# EAGLE design ArduinoUhr_LCD (EAGLE 9.6.2)
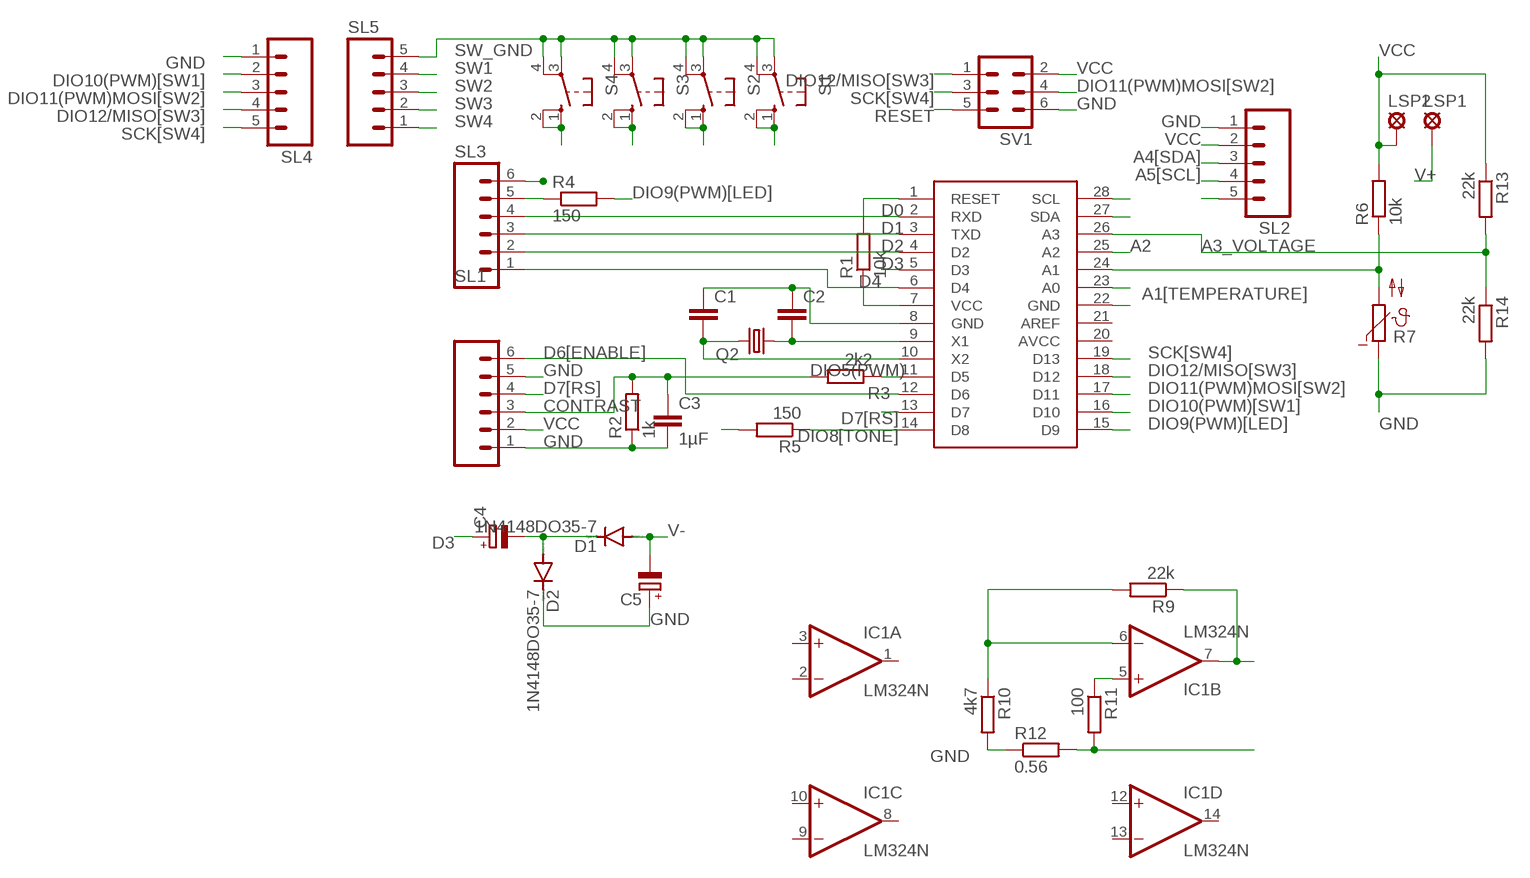
[diagram p0: schematic, sheet 1]

## Parts
C1  C-EU025-024X044  [C025-024X044]
C2  C-EU025-024X044  [C025-024X044]
C3  1µF  C-EU050-024X044  [C050-024X044]
C4  CPOL-EUE2-5  [E2-5]
C5  CPOL-EUE2-5  [E2-5]
D1  1N4148DO35-7  [DO35-7]
D2  1N4148DO35-7  [DO35-7]
IC1  LM324N  [DIL14]
LSP1  LSP10  [LSP10]
LSP2  LSP10  [LSP10]
Q2  CRYSTALHC49S  [HC49/S]
R1  10k  R-EU_0207/15  [0207/15]
R2  1k  R-EU_0204/7  [0204/7]
R3  2k2  R-EU_0204/7  [0204/7]
R4  150  R-EU_0207/10  [0207/10]
R5  150  R-EU_0204/7  [0204/7]
R6  10k  R-EU_0207/10  [0207/10]
R7  NTC640-9  [N640]
R9  22k  R-EU_0204/7  [0204/7]
R10  4k7  R-EU_0204/7  [0204/7]
R11  100  R-EU_0204/7  [0204/7]
R12  0.56  R-EU_0613/15  [P0613/15]
R13  22k  R-EU_0204/7  [0204/7]
R14  22k  R-EU_0204/7  [0204/7]
S1  10-XX  [B3F-10XX]
S2  10-XX  [B3F-10XX]
S3  10-XX  [B3F-10XX]
S4  10-XX  [B3F-10XX]
SL1  M06  [06P]
SL2  M05  [05P]
SL3  M06  [06P]
SL4  M05  [05P]
SL5  M05  [05P]
SV1  MA03-2  [MA03-2]
U$1  ATMEGA328P-PU  [DIL28-3]

## Nets
A0[CURRENT]: IC1.7(B:OUT) R9.1 U$1.23(A0)
A1[TEMPERATURE]: R6.1 R7.2 U$1.24(A1)
A2: U$1.25(A2)
A3_VOLTAGE: R13.2 R14.1 U$1.26(A3)
A4[SDA]: SL2.3 U$1.27(SDA)
A5[SCL]: SL2.4 U$1.28(SCL)
CONTRAST: C3.1 R2.2 R3.2 SL1.3
D0: SL3.4 U$1.2(RXD)
D1: SL3.3 U$1.3(TXD)
D2: SL3.2 U$1.4(D2)
D3: C4.+ U$1.5(D3)
D4: SL3.1 U$1.6(D4)
D6[ENABLE]: SL1.6 U$1.12(D6)
D7[RS]: SL1.4 U$1.13(D7)
DIO5(PWM): R3.1 U$1.11(D5)
DIO8[TONE]: R5.1 U$1.14(D8)
DIO9(PWM)[LED]: R4.2 U$1.15(D9)
DIO10(PWM)[SW1]: SL4.2 U$1.16(D10)
DIO11(PWM)MOSI[SW2]: SL4.3 SV1.4 U$1.17(D11)
DIO12/MISO[SW3]: SL4.4 SV1.1 U$1.18(D12)
GND: C1.1 C2.1 C3.2 C5.+ D2.C R2.1 R7.1 R10.2 R12.1 R14.2 SL1.1 SL1.5 SL2.1 SL3.6 SL4.1 SV1.6 U$1.8(GND) U$1.22(GND)
N$1: IC1.6(B:-IN) R9.2 R10.1
N$2: R4.1 SL3.5
N$4: C4.- D1.C D2.A
N$6: IC1.5(B:+IN) R11.1
N$7: SL2.5
N$8: R11.2 R12.2
RESET: R1.2 SV1.5 U$1.1(RESET)
SCK[SW4]: SL4.5 SV1.3 U$1.19(D13)
SW1: S4.1(S) S4.2(S1) SL5.4
SW2: S3.1(S) S3.2(S1) SL5.3
SW3: S2.1(S) S2.2(S1) SL5.2
SW4: S1.1(S) S1.2(S1) SL5.1
SW_GND: S1.3(P) S1.4(P1) S2.3(P) S2.4(P1) S3.3(P) S3.4(P1) S4.3(P) S4.4(P1) SL5.5
TONE: R5.2
V+: LSP1.MP
V-: C5.- D1.A
VCC: LSP2.MP R1.1 R6.2 R13.1 SL1.2 SL2.2 SV1.2 U$1.7(VCC)
X1: C2.2 Q2.1 U$1.9(X1)
X2: C1.2 Q2.2 U$1.10(X2)
Unconnected: IC1.1(A:OUT) IC1.2(A:-IN) IC1.3(A:+IN) IC1.8(C:OUT) IC1.9(C:-IN) IC1.10(C:+IN) IC1.12(D:+IN) IC1.13(D:-IN) IC1.14(D:OUT) U$1.20(AVCC) U$1.21(AREF)

## Power pins joined to a net without a drawn wire
V+: IC1.4(P:V+)
V-: IC1.11(P:V-)

## Library data of the parts
C1 C2 = rcl:C-EU: CAPACITOR, European symbol
C3 = rcl:C-EU: CAPACITOR, European symbol; SPICEPREFIX: C
C4 C5 = rcl:CPOL-EU: POLARIZED CAPACITOR, European symbol; SPICEPREFIX: C
D1 D2 = diode:1N4148: DIODE high speed (Philips)
IC1 = linear:LM324: OP AMP
LSP1 LSP2 = solpad:LSP10: SOLDER PAD drill 1.0 mm, distributor Buerklin, 12H555
Q2 = crystal:CRYSTAL: CRYSTAL; OC_FARNELL: 1667008; OC_NEWARK: unknown
R1 = rcl:R-EU_: RESISTOR, European symbol
R2 R3 R5 R9-R14 = rcl:R-EU_: RESISTOR, European symbol; SPICEPREFIX: R
R4 R6 = resistor:R-EU_: RESISTOR, European symbol
R7 = ptc-ntc:NTC640-9: PHILIPS NTC; OC_FARNELL: unknown; OC_NEWARK: unknown
S1-S4 = switch-omron:10-XX: OMRON SWITCH; MPN: B3F-1000; OC_FARNELL: 176432; OC_NEWARK: 36M3542
SL1 SL3 = con-amp-quick:M06: AMP QUICK CONNECTOR; OC_FARNELL: unknown; OC_NEWARK: unknown
SL2 SL4 SL5 = con-amp-quick:M05: AMP QUICK CONNECTOR; OC_FARNELL: unknown; OC_NEWARK: unknown
SV1 = con-lstb:MA03-2: PIN HEADER; OC_FARNELL: unknown; OC_NEWARK: unknown
U$1 = atmel2:ATMEGA328P-PU

## Board
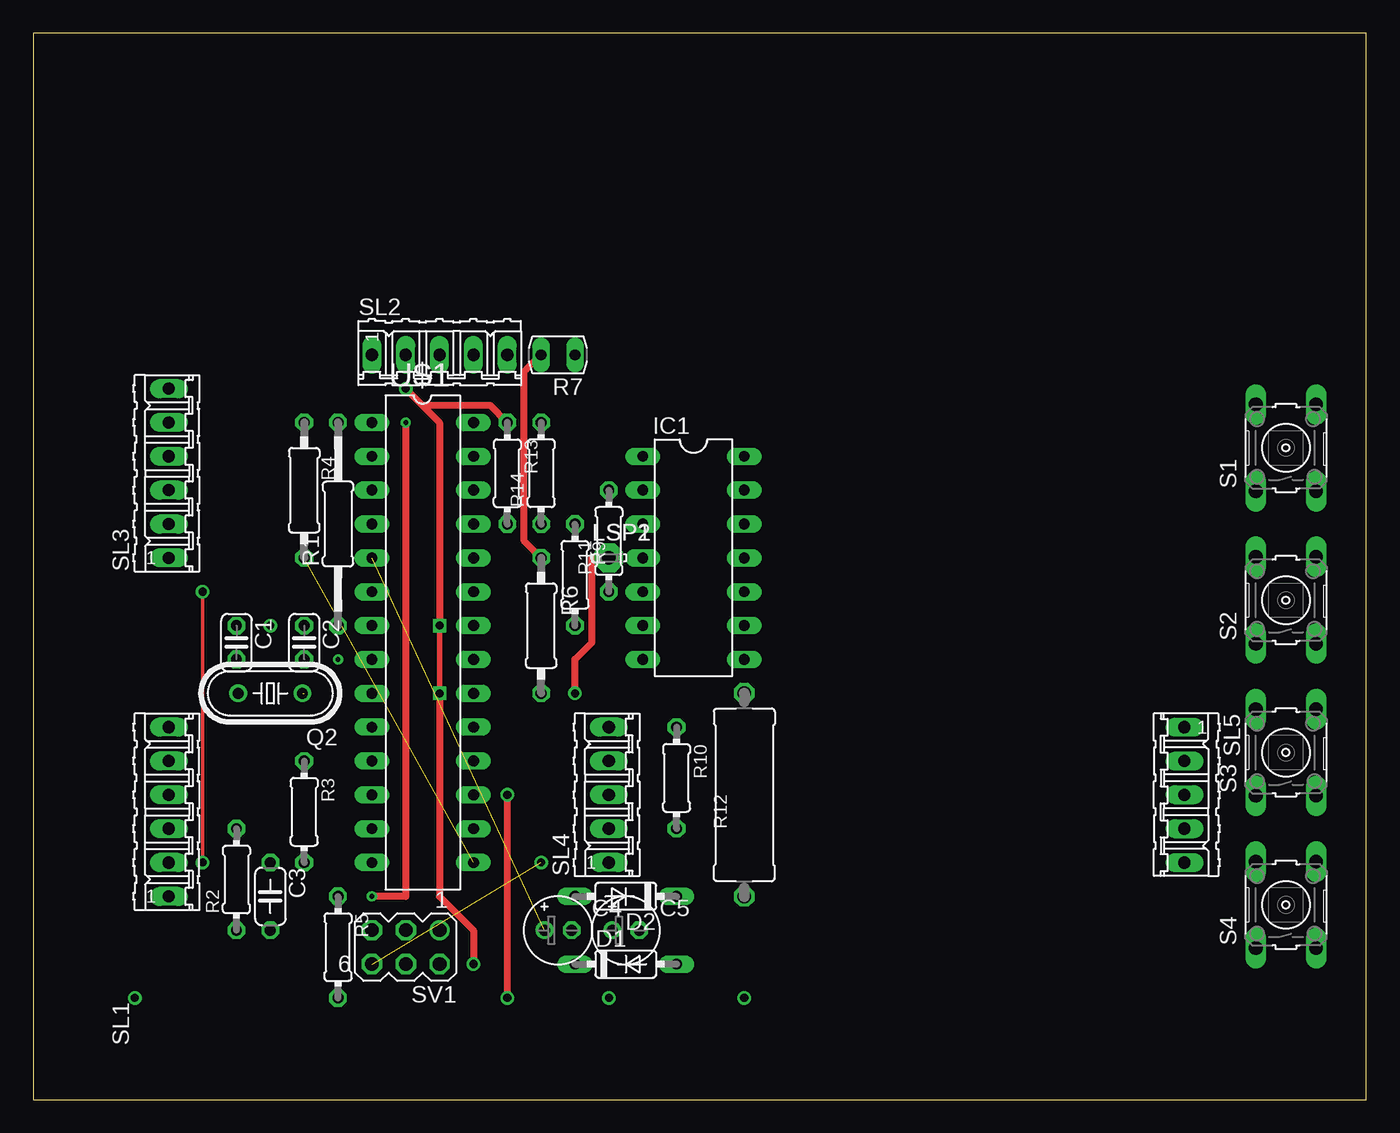
[diagram p1: board, top side]
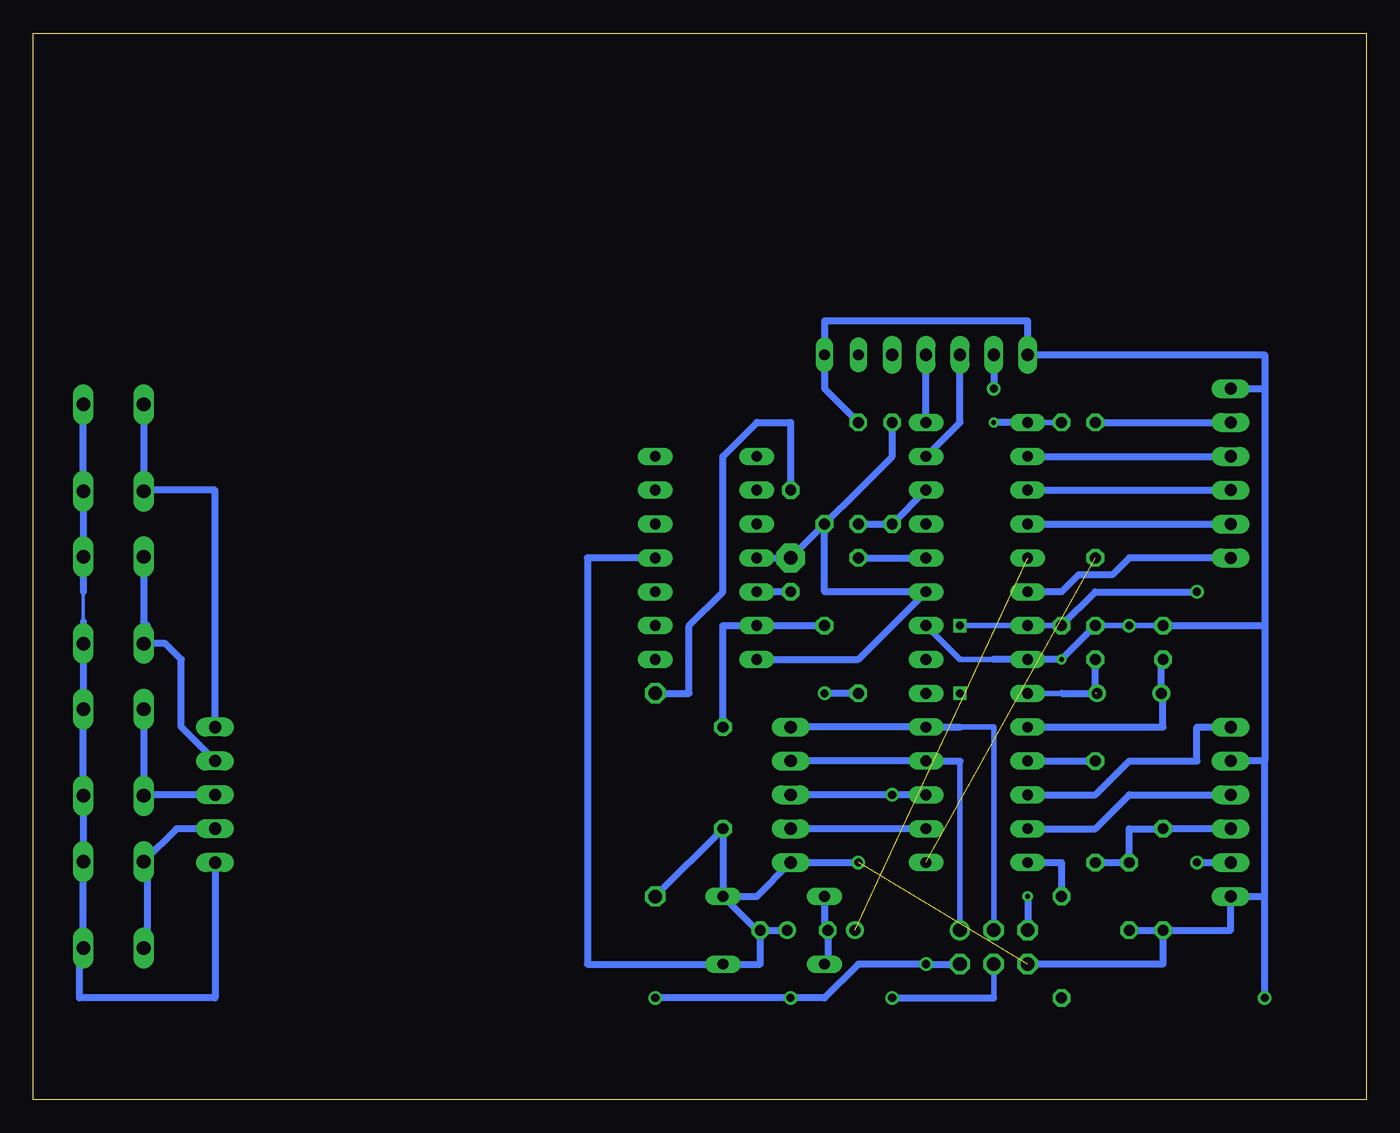
[diagram p2: board, bottom side, seen from below]

Size 100 x 80 mm. Coordinates in mm from the lower left corner, seen from the top.
Outline: 0,0 100,0 100,80 0,80 0,0
Copper layers (1*16): Top 0.035mm / dielectric 1.5mm / Bottom 0.035mm
Design rules "default": minimum track width 10mil, minimum drill 24mil, track to track 8mil, track to pad 8mil, pad to pad 8mil, via to via 8mil, smd to smd 8mil, copper to edge 40mil, drill to drill 8mil, minimum pad ring 10mil, minimum via ring 8mil, stop-mask expansion 4mil, vias tented up to drill 0mil, thermal gap 10mil

### Footprints (pad centres in the part's own frame; a part is rotated, then mirrored left to right if it is on the bottom)
C025-024X044 = drill 0.813 octagon: 1 -1.27,0; 2 1.27,0
C050-024X044 = drill 0.813 octagon: 1 -2.54,0; 2 2.54,0
E2-5 = drill 0.813 pad 1.27: + -1.016,0 | drill 0.813 pad 1.27 octagon: - 1.016,0
DO35-7 = drill 0.813 long: A 3.81,0; C -3.81,0
DIL14 = drill 0.813 long: 1 -7.62,-3.81; 2 -5.08,-3.81; 3 -2.54,-3.81; 4 0,-3.81; 5 2.54,-3.81; 6 5.08,-3.81; 7 7.62,-3.81; 8 7.62,3.81; 9 5.08,3.81; 10 2.54,3.81; 11 0,3.81; 12 -2.54,3.81; 13 -5.08,3.81; 14 -7.62,3.81
LSP10 = drill 1.016 pad 2.159 octagon: MP 0,0
HC49/S = drill 0.813: 1 -2.413,0; 2 2.413,0
0207/15 = drill 0.813 octagon: 1 -7.62,0; 2 7.62,0
0204/7 = drill 0.813 octagon: 1 -3.81,0; 2 3.81,0
0207/10 = drill 0.813 octagon: 1 -5.08,0; 2 5.08,0
N640 = drill 0.813 long: 1 -1.27,0; 2 1.27,0
P0613/15 = drill 1.016 octagon: 1 -7.62,0; 2 7.62,0
B3F-10XX = drill 1.016 long: 1 -3.251,2.261; 2 3.251,2.261; 3 -3.251,-2.261; 4 3.251,-2.261
06P = drill 0.914 long: 1 -6.35,0; 2 -3.81,0; 3 -1.27,0; 4 1.27,0; 5 3.81,0; 6 6.35,0
05P = drill 0.914 long: 1 -5.08,0; 2 -2.54,0; 3 0,0; 4 2.54,0; 5 5.08,0
MA03-2 = drill 1.016: 1 -2.54,-1.27 | drill 1.016 octagon: 2 -2.54,1.27; 3 0,-1.27; 4 0,1.27; 5 2.54,-1.27; 6 2.54,1.27
DIL28-3 = drill 0.813 long: 1 -16.51,-3.81; 2 -13.97,-3.81; 3 -11.43,-3.81; 4 -8.89,-3.81; 5 -6.35,-3.81; 6 -3.81,-3.81; 7 -1.27,-3.81; 8 1.27,-3.81; 9 3.81,-3.81; 10 6.35,-3.81; 11 8.89,-3.81; 12 11.43,-3.81; 13 13.97,-3.81; 14 16.51,-3.81; 15 16.51,3.81; 16 13.97,3.81; 17 11.43,3.81; 18 8.89,3.81; 19 6.35,3.81; 20 3.81,3.81; 21 1.27,3.81; 22 -1.27,3.81; 23 -3.81,3.81; 24 -6.35,3.81; 25 -8.89,3.81; 26 -11.43,3.81; 27 -13.97,3.81; 28 -16.51,3.81

### Placement (x,y rotation side)
C1  15.24,34.29 270 top
C2  20.32,34.29 270 top
C3  17.78,15.24 270 top
C4  39.37,12.7 0 top
C5  44.45,12.7 0 top
D1  44.45,10.16 0 top
D2  44.45,15.24 180 top
IC1  49.53,40.64 270 top
LSP1  43.18,40.64 0 top
LSP2  43.18,40.64 0 top
Q2  17.78,30.48 180 top
R1  22.86,43.18 90 top
R2  15.24,16.51 90 top
R3  20.32,21.59 270 top
R4  20.32,45.72 270 top
R5  22.86,11.43 270 top
R6  38.1,35.56 270 top
R7  39.37,55.88 180 top
R9  40.64,39.37 270 top
R10  48.26,24.13 270 top
R11  43.18,41.91 90 top
R12  53.34,22.86 90 top
R13  35.56,46.99 270 top
R14  38.1,46.99 90 top
S1  93.98,48.9 90 top
S2  93.98,37.47 90 top
S3  93.98,26.04 90 top
S4  93.98,14.61 90 top
SL1  10.16,21.59 90 top
SL2  30.48,55.88 0 top
SL3  10.16,46.99 90 top
SL4  43.18,22.86 90 top
SL5  86.36,22.86 270 top
SV1  27.94,11.43 180 top
U$1  29.21,34.29 270 top

### Tracks (layer width: path | path; a pad name or v marks a point on that pad's centre or on a via)
A0[CURRENT]
  Bottom 0.508: IC1.7 38.1,33.02 U$1.23 40.64,38.1 R9.1
A1[TEMPERATURE]
  Top 0.508: R6.1 36.83,41.91 36.83,54.61 R7.2
  Bottom 0.508: R6.1 U$1.24
A3_VOLTAGE
  Bottom 0.508: R14.1 R13.2 U$1.26
A4[SDA]
  Bottom 0.508: U$1.27 30.48,50.8 SL2.3
A5[SCL]
  Bottom 0.508: U$1.28 SL2.4
CONTRAST
  Bottom 0.508: R3.2 C3.1 17.78,20.32 R2.2 SL1.3
D0
  Bottom 0.508: U$1.2 SL3.4
D1
  Bottom 0.508: U$1.3 SL3.3
D2
  Bottom 0.508: U$1.4 SL3.2
D3  (1 unrouted)
D4
  Bottom 0.508: SL3.1 17.78,40.64 19.05,39.37 21.59,39.37 22.86,38.1 U$1.6
D6[ENABLE]
  Bottom 0.508: U$1.12 20.32,22.86 17.78,25.4 12.7,25.4 12.7,27.94 SL1.6
D7[RS]
  Bottom 0.508: SL1.4 17.78,22.86 20.32,20.32 U$1.13
DIO5(PWM)
  Bottom 0.508: U$1.11 R3.1
DIO8[TONE]
  Bottom 0.508: U$1.14 22.86,17.78 R5.1
DIO9(PWM)[LED]  (1 unrouted)
DIO10(PWM)[SW1]
  Bottom 0.508: U$1.16 SL4.2
DIO11(PWM)MOSI[SW2]  (via drill 0.61)
  Top 0.508: v35.56,22.86 v35.56,7.62
  Bottom 0.406: 27.94,7.62 SV1.4
  Bottom 0.508: v35.56,7.62 27.94,7.62 | U$1.17 v35.56,22.86 | 35.64,22.78 v35.56,22.86 | v35.56,22.86 SL4.3
DIO12/MISO[SW3]
  Bottom 0.406: 30.48,25.4 SV1.1
  Bottom 0.508: 30.48,25.4 U$1.18 SL4.4
GND  (via drill 0.35, 0.61)  (1 unrouted)
  Bottom 0.406: C2.1 v17.78,35.56 C1.1 | 27.94,33.02 30.48,33.02 U$1.22
  Bottom 0.508: 27.94,33.02 U$1.8 v22.86,33.02 C2.1 | R2.1 15.24,10.16 SV1.6 | C3.2 R2.1 | 7.62,53.34 7.62,55.88 SL2.1 25.4,58.42 40.64,58.42 R7.1 40.64,53.34 R14.2 | 7.62,53.34 7.62,35.56 | 7.62,35.56 7.62,25.4 | 7.62,25.4 SL1.5 | C1.1 7.62,35.56 | 7.62,15.24 SL1.1 10.16,12.7 R2.1 | 7.62,15.24 7.62,25.4 | SL3.6 7.62,53.34 | v7.62,7.62 7.62,15.24 | v38.1,17.78 SL4.1 45.72,15.24 D2.C | D2.C 45.72,12.7 C5.+ | R12.1 R10.2 D2.C
  other vias: 25.4,10.16
N$1
  Bottom 0.508: R9.2 IC1.6 48.26,35.56 R10.1
N$2
  Bottom 0.508: R4.1 SL3.5
N$4
  Bottom 0.508: D1.C 40.39,10.41 C4.- 40.64,12.95 D2.A
N$6
  Bottom 0.508: R11.1 IC1.5
N$8
  Bottom 0.508: R12.2 50.8,30.48 50.8,35.56 48.26,38.1 48.26,48.26 45.72,50.8 43.18,50.8 R11.2
RESET  (via drill 0.35)
  Top 0.508: v27.94,50.8 27.94,15.24 v25.4,15.24
  Bottom 0.406: U$1.1 R1.2
  Bottom 0.508: U$1.1 v27.94,50.8 | v25.4,15.24 SV1.5
SCK[SW4]
  Bottom 0.406: SV1.3 27.94,27.94 30.48,27.94
  Bottom 0.508: 30.48,27.94 U$1.19 SL4.5
SW1
  Bottom 0.508: SL5.4 89.26,20.32 S4.2 91.44,17.58 91.44,10.16 91.72,10.44 S4.1
SW2
  Bottom 0.508: SL5.3 91.64,22.86 | 91.64,22.86 S3.1 | S3.2 91.72,22.94 91.64,22.86
SW3
  Bottom 0.508: SL5.2 88.9,27.94 88.9,33.02 90.09,34.21 91.44,34.21 | 91.44,34.21 S2.1 | S2.2 91.72,35.84 91.44,35.56 91.44,34.21
SW4
  Bottom 0.508: SL5.1 86.36,45.72 91.64,45.72 | 91.64,45.72 S1.1 | S1.2 91.72,45.8 91.64,45.72
SW_GND  (via drill 0.61)
  Top 0.254: 96.52,33.02 96.52,33.93 S2.3
  Bottom 0.254: 96.24,38.1 96.24,35.84
  Bottom 0.508: 96.24,35.84 S2.3 S3.4 S3.3 S4.4 S4.3 96.52,11.07 96.52,7.62 86.36,7.62 SL5.5 | 96.24,38.1 S2.4 S1.3 S1.4 96.24,53.06 96.52,53.34
  other vias: 96.24,34.21
V+  (via drill 0.61)
  Bottom 0.508: IC1.4 LSP1.MP
  other vias: 45.72,40.64
V-
  Bottom 0.508: C5.- 45.47,10.16 58.42,10.16 58.42,40.64 IC1.11 | 48.01,10.16 D1.A
VCC  (via drill 0.6, 0.61)
  Top 0.254: v12.7,38.1 v12.7,17.78
  Top 0.406: v30.48,35.56 v30.48,30.48
  Top 0.508: v30.48,30.48 30.48,15.24 33.02,12.7 v33.02,10.16 | v27.94,53.34 29.21,52.07 | 29.21,52.07 30.48,50.8 v30.48,35.56 | R13.1 34.29,52.07 29.21,52.07 | v40.64,30.48 40.64,33.02 41.91,34.29 41.91,40.64 LSP2.MP
  Bottom 0.406: v30.48,35.56 U$1.7 R1.1
  Bottom 0.508: SV1.2 v33.02,10.16 38.1,10.16 40.64,7.62 v43.18,7.62 v53.34,7.62 | SL2.2 v27.94,53.34 | R1.1 20.32,38.1 v12.7,38.1 | v12.7,17.78 SL1.2 | R6.2 v40.64,30.48 | LSP2.MP 35.56,48.26 R13.1
X1  (1 unrouted)
  Bottom 0.406: U$1.9 22.86,30.48
  Bottom 0.508: 22.86,30.48 20.32,30.48 | Q2.1 20.32,30.61 C2.2
X2
  Bottom 0.508: U$1.10 15.24,27.94 15.24,30.35 Q2.2 15.37,32.89 C1.2

### Text on the board
Document: A5[SCL] | DPIO0(RX) | A4[SDA] | DIO1(TX) | A3 | DIO2 | A2 | DIO3(PWM) | A1 | DIO4 | A0 | AREF | SCK | DIO5(PWM) | DIO12/MISO | DIO6(PWM) | DIO11(PWM)MOSI | DIO7 | DIO10(PWM) | DIO8 | DIO9(PWM)